# EAGLE design ESP32_Schematic (EAGLE 9.6.2)
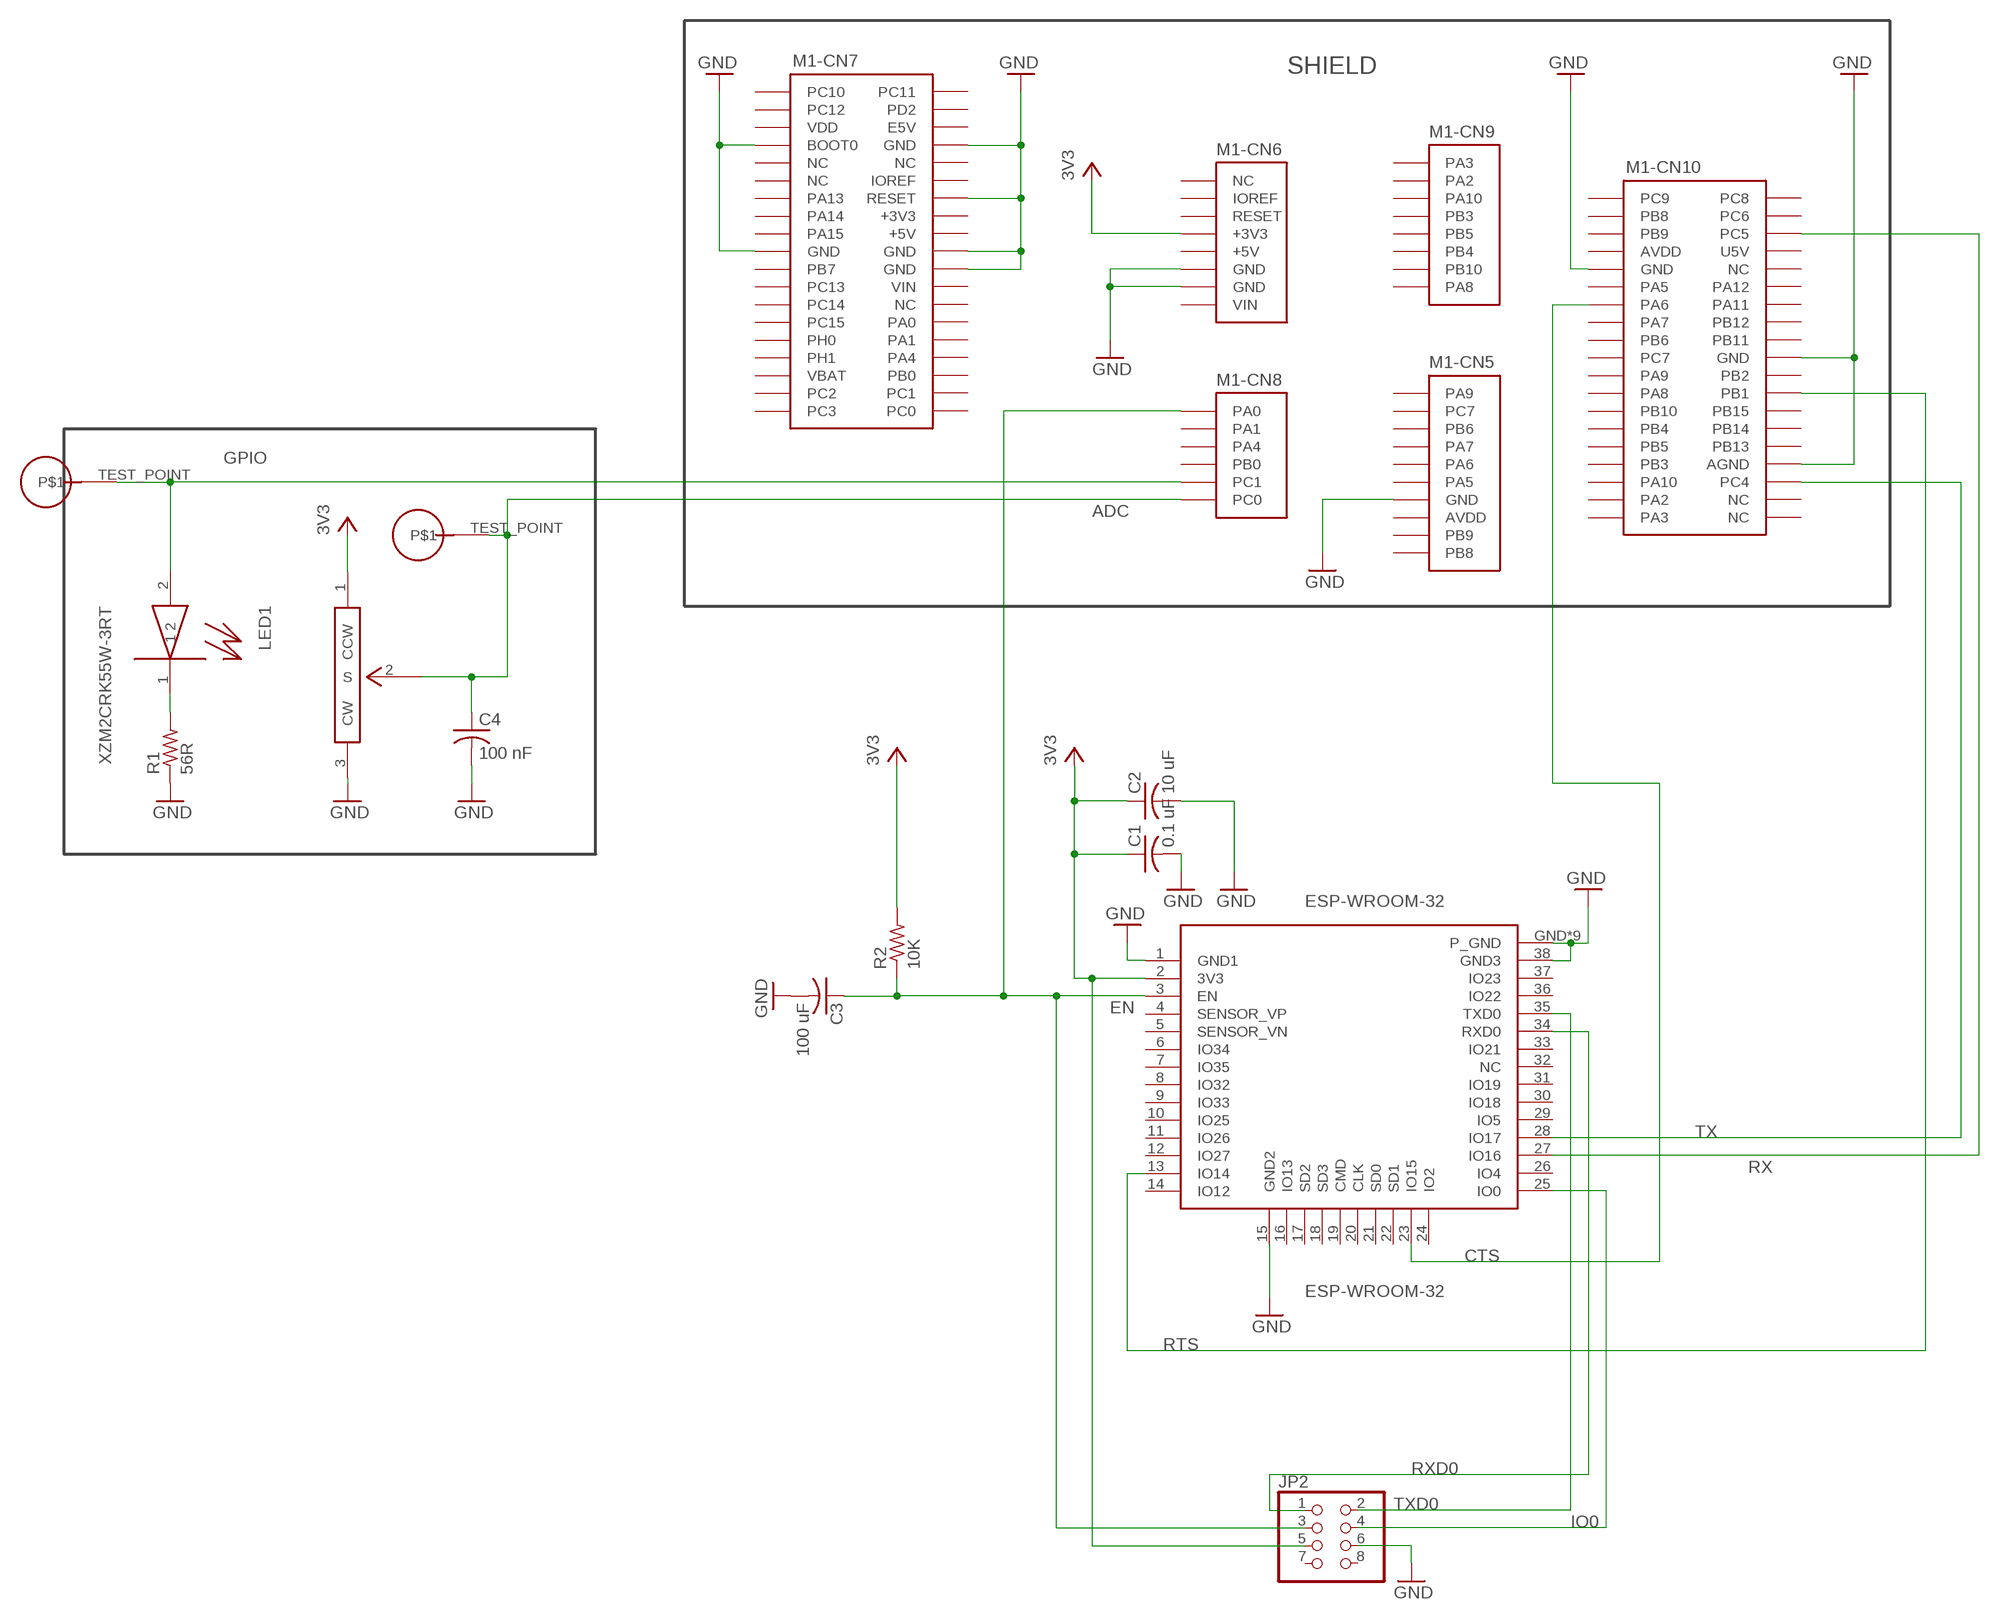
[diagram p0: schematic, sheet 1]

## Parts
C1  0.1 uF  C-USC0805  [C0805]
C2  10 uF  C-USC0805  [C0805]
C3  100 uF  C-USC0805  [C0805]
C4  100 nF  C-USC0805  [C0805]
ESP-WROOM-32  ESP-WROOM-32  [ESP-WROOM-32]
JP2  PINHD-2X4  [2X04]
LED1  XZM2CRK55W-3RT  [CHIPLED]
M1  NUCLEO-L452RE  [NUCLEO-64]
POT1  P160KNP  [P160KN-0QD15B10K]
R1  56R  R-US_R0805  [R0805]
R2  10K  R-US_R0805  [R0805]
TP_LED  TEST_POINT  [TEST_POINT]
TP_POT  TEST_POINT  [TEST_POINT]

## Nets
ADC: C4.1 M1.CN8-6(-CN8:PC0) POT1.2(S) TP_POT.TEST_POINT
CTS: ESP-WROOM-32.23(IO15) M1.CN10-13(-CN10:PA6)
EN: C3.1 ESP-WROOM-32.3(EN) JP2.3 M1.CN8-1(-CN8:PA0) R2.1
GND: C1.2 C2.2 C3.2 C4.2 ESP-WROOM-32.1(GND1) ESP-WROOM-32.15(GND2) ESP-WROOM-32.38(GND3) ESP-WROOM-32.GND1(P_GND) ESP-WROOM-32.GND2(P_GND) ESP-WROOM-32.GND3(P_GND) ESP-WROOM-32.GND4(P_GND) ESP-WROOM-32.GND5(P_GND) ESP-WROOM-32.GND6(P_GND) ESP-WROOM-32.GND7(P_GND) ESP-WROOM-32.GND8(P_GND) ESP-WROOM-32.GND(P_GND) JP2.6 M1.CN5-7(-CN5:GND) M1.CN6-6(-CN6:GND) M1.CN6-7(-CN6:GND) M1.CN7-7(-CN7:BOOT0) M1.CN7-8(-CN7:GND) M1.CN7-14(-CN7:RESET) M1.CN7-19(-CN7:GND) M1.CN7-20(-CN7:GND) M1.CN7-22(-CN7:GND) M1.CN10-9(-CN10:GND) M1.CN10-20(-CN10:GND) M1.CN10-32(-CN10:AGND) POT1.3(CW) R1.1
GPIO: LED1.2 M1.CN8-5(-CN8:PC1) TP_LED.TEST_POINT
IO0: ESP-WROOM-32.25(IO0) JP2.4
N$8: LED1.1 R1.2
RTS: ESP-WROOM-32.13(IO14) M1.CN10-24(-CN10:PB1)
RX: ESP-WROOM-32.27(IO16) M1.CN10-6(-CN10:PC5)
RXD0: ESP-WROOM-32.34(RXD0) JP2.1
TX: ESP-WROOM-32.28(IO17) M1.CN10-34(-CN10:PC4)
TXD0: ESP-WROOM-32.35(TXD0) JP2.2
VCC: C1.1 C2.1 ESP-WROOM-32.2(3V3) JP2.5 M1.CN6-4(-CN6:+3V3) POT1.1(CCW) R2.2 ; supply symbol labelled 3V3
Unconnected: ESP-WROOM-32.4(SENSOR_VP) ESP-WROOM-32.5(SENSOR_VN) ESP-WROOM-32.6(IO34) ESP-WROOM-32.7(IO35) ESP-WROOM-32.8(IO32) ESP-WROOM-32.9(IO33) ESP-WROOM-32.10(IO25) ESP-WROOM-32.11(IO26) ESP-WROOM-32.12(IO27) ESP-WROOM-32.14(IO12) ESP-WROOM-32.16(IO13) ESP-WROOM-32.17(SD2) ESP-WROOM-32.18(SD3) ESP-WROOM-32.19(CMD) ESP-WROOM-32.20(CLK) ESP-WROOM-32.21(SD0) ESP-WROOM-32.22(SD1) ESP-WROOM-32.24(IO2) ESP-WROOM-32.26(IO4) ESP-WROOM-32.29(IO5) ESP-WROOM-32.30(IO18) ESP-WROOM-32.31(IO19) ESP-WROOM-32.32(NC) ESP-WROOM-32.33(IO21) ESP-WROOM-32.36(IO22) ESP-WROOM-32.37(IO23) JP2.7 JP2.8 M1.CN5-1(-CN5:PA9) M1.CN5-2(-CN5:PC7) M1.CN5-3(-CN5:PB6) M1.CN5-4(-CN5:PA7) M1.CN5-5(-CN5:PA6) M1.CN5-6(-CN5:PA5) M1.CN5-9(-CN5:PB9) M1.CN5-10(-CN5:PB8) M1.CN6-1(-CN6:NC) M1.CN6-3(-CN6:RESET) M1.CN7-1(-CN7:PC10) M1.CN7-2(-CN7:PC11) M1.CN7-3(-CN7:PC12) M1.CN7-4(-CN7:PD2) M1.CN7-6(-CN7:E5V) M1.CN7-9(-CN7:NC) M1.CN7-10(-CN7:NC) M1.CN7-11(-CN7:NC) M1.CN7-12(-CN7:IOREF) M1.CN7-13(-CN7:PA13) M1.CN7-15(-CN7:PA14) M1.CN7-17(-CN7:PA15) M1.CN7-21(-CN7:PB7) M1.CN7-23(-CN7:PC13) M1.CN7-25(-CN7:PC14) M1.CN7-26(-CN7:NC) M1.CN7-27(-CN7:PC15) M1.CN7-28(-CN7:PA0) M1.CN7-29(-CN7:PH0) M1.CN7-30(-CN7:PA1) M1.CN7-31(-CN7:PH1) M1.CN7-32(-CN7:PA4) M1.CN7-34(-CN7:PB0) M1.CN7-35(-CN7:PC2) M1.CN7-36(-CN7:PC1) M1.CN7-37(-CN7:PC3) M1.CN7-38(-CN7:PC0) M1.CN8-2(-CN8:PA1) M1.CN8-3(-CN8:PA4) M1.CN8-4(-CN8:PB0) M1.CN9-1(-CN9:PA3) M1.CN9-2(-CN9:PA2) M1.CN9-3(-CN9:PA10) M1.CN9-4(-CN9:PB3) M1.CN9-5(-CN9:PB5) M1.CN9-6(-CN9:PB4) M1.CN9-7(-CN9:PB10) M1.CN9-8(-CN9:PA8) M1.CN10-1(-CN10:PC9) M1.CN10-2(-CN10:PC8) M1.CN10-3(-CN10:PB8) M1.CN10-4(-CN10:PC6) M1.CN10-5(-CN10:PB9) M1.CN10-10(-CN10:NC) M1.CN10-11(-CN10:PA5) M1.CN10-12(-CN10:PA12) M1.CN10-14(-CN10:PA11) M1.CN10-15(-CN10:PA7) M1.CN10-16(-CN10:PB12) M1.CN10-17(-CN10:PB6) M1.CN10-18(-CN10:PB11) M1.CN10-19(-CN10:PC7) M1.CN10-21(-CN10:PA9) M1.CN10-22(-CN10:PB2) M1.CN10-23(-CN10:PA8) M1.CN10-25(-CN10:PB10) M1.CN10-26(-CN10:PB15) M1.CN10-27(-CN10:PB4) M1.CN10-28(-CN10:PB14) M1.CN10-29(-CN10:PB5) M1.CN10-30(-CN10:PB13) M1.CN10-31(-CN10:PB3) M1.CN10-33(-CN10:PA10) M1.CN10-35(-CN10:PA2) M1.CN10-36(-CN10:NC) M1.CN10-37(-CN10:PA3) M1.CN10-38(-CN10:NC)

## Notes on the sheet
- SHIELD

## Power pins joined to a net without a drawn wire
+3V3: M1.CN7-16(-CN7:+3V3)
+5V: M1.CN6-5(-CN6:+5V) M1.CN7-18(-CN7:+5V)
AVDD: M1.CN5-8(-CN5:AVDD) M1.CN10-7(-CN10:AVDD)
IOREF: M1.CN6-2(-CN6:IOREF)
U5V: M1.CN10-8(-CN10:U5V)
VBAT: M1.CN7-33(-CN7:VBAT)
VDD: M1.CN7-5(-CN7:VDD)
VIN: M1.CN6-8(-CN6:VIN) M1.CN7-24(-CN7:VIN)

## Library data of the parts
C1 C4 = C-US:C-US: CAPACITOR, American symbol; PARTNO: GCM21BR72A104KA37L; SPICEPREFIX: C
C2 = C-US:C-US: CAPACITOR, American symbol; PARTNO: GRM21BR61C106KE15L; SPICEPREFIX: C
C3 = C-US:C-US: CAPACITOR, American symbol; PARTNO: GRM21BR60J107ME15L; SPICEPREFIX: C
ESP-WROOM-32 = ESP-WROOOM-32:ESP-WROOM-32
JP2 = pinhead:PINHD-2X4: PIN HEADER; PARTNO: 220-1-08-003
LED1 = XZM2CRK55W-3RT - SunLED:XZM2CRK55W-3RT; PARTNO: XZM2CRK55W-3RT
M1 = NUCLEO-L452RE:NUCLEO-L452RE: No existe un outline (Layer Dimension) para esta librería. En su lugar se utilizó una referencia en tDocu. Al momento de diseñar la tarjeta, el Dimension debe ser dibujado según los requerimientos del usuario, o simplemente copiar los contenidos del tDocu en Dimensions.
POT1 = P160KNP:P160KNP
R1 = R-US:R-US_: RESISTOR, American symbol; PARTNO: RC0805JR-0756RL; SPICEPREFIX: R
R2 = R-US:R-US_: RESISTOR, American symbol; PARTNO: RC0805FR-0710KL; SPICEPREFIX: R
TP_LED TP_POT = TEST_POINT:TEST_POINT

## Board
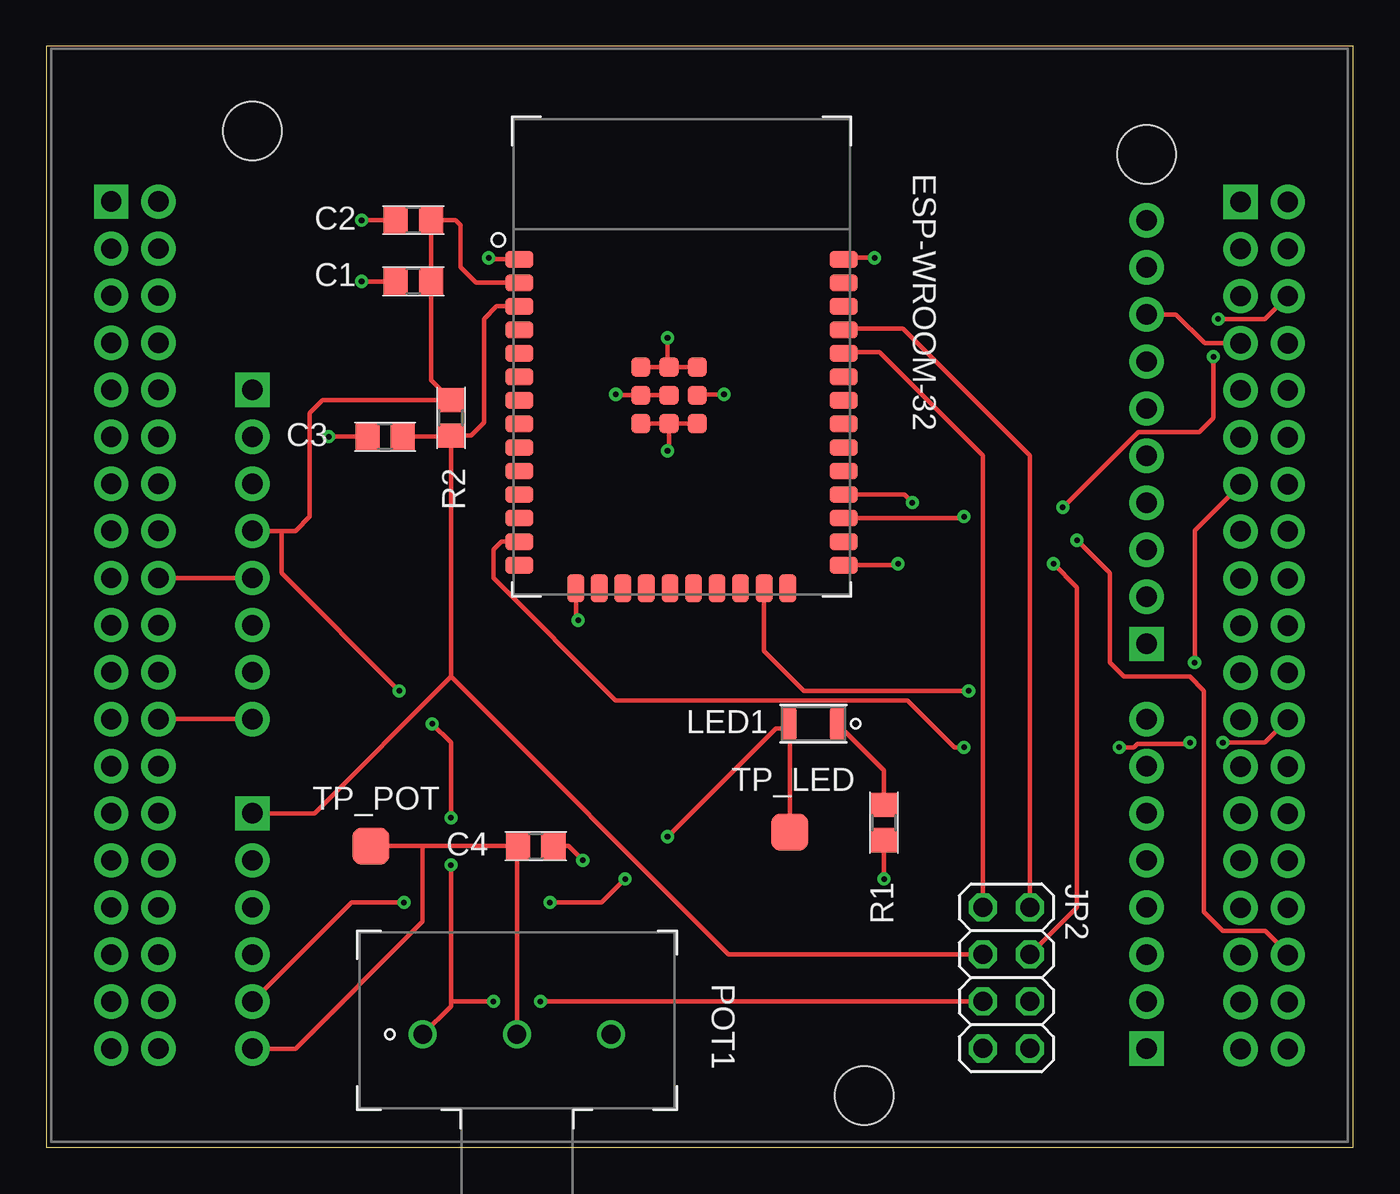
[diagram p1: board, top side]
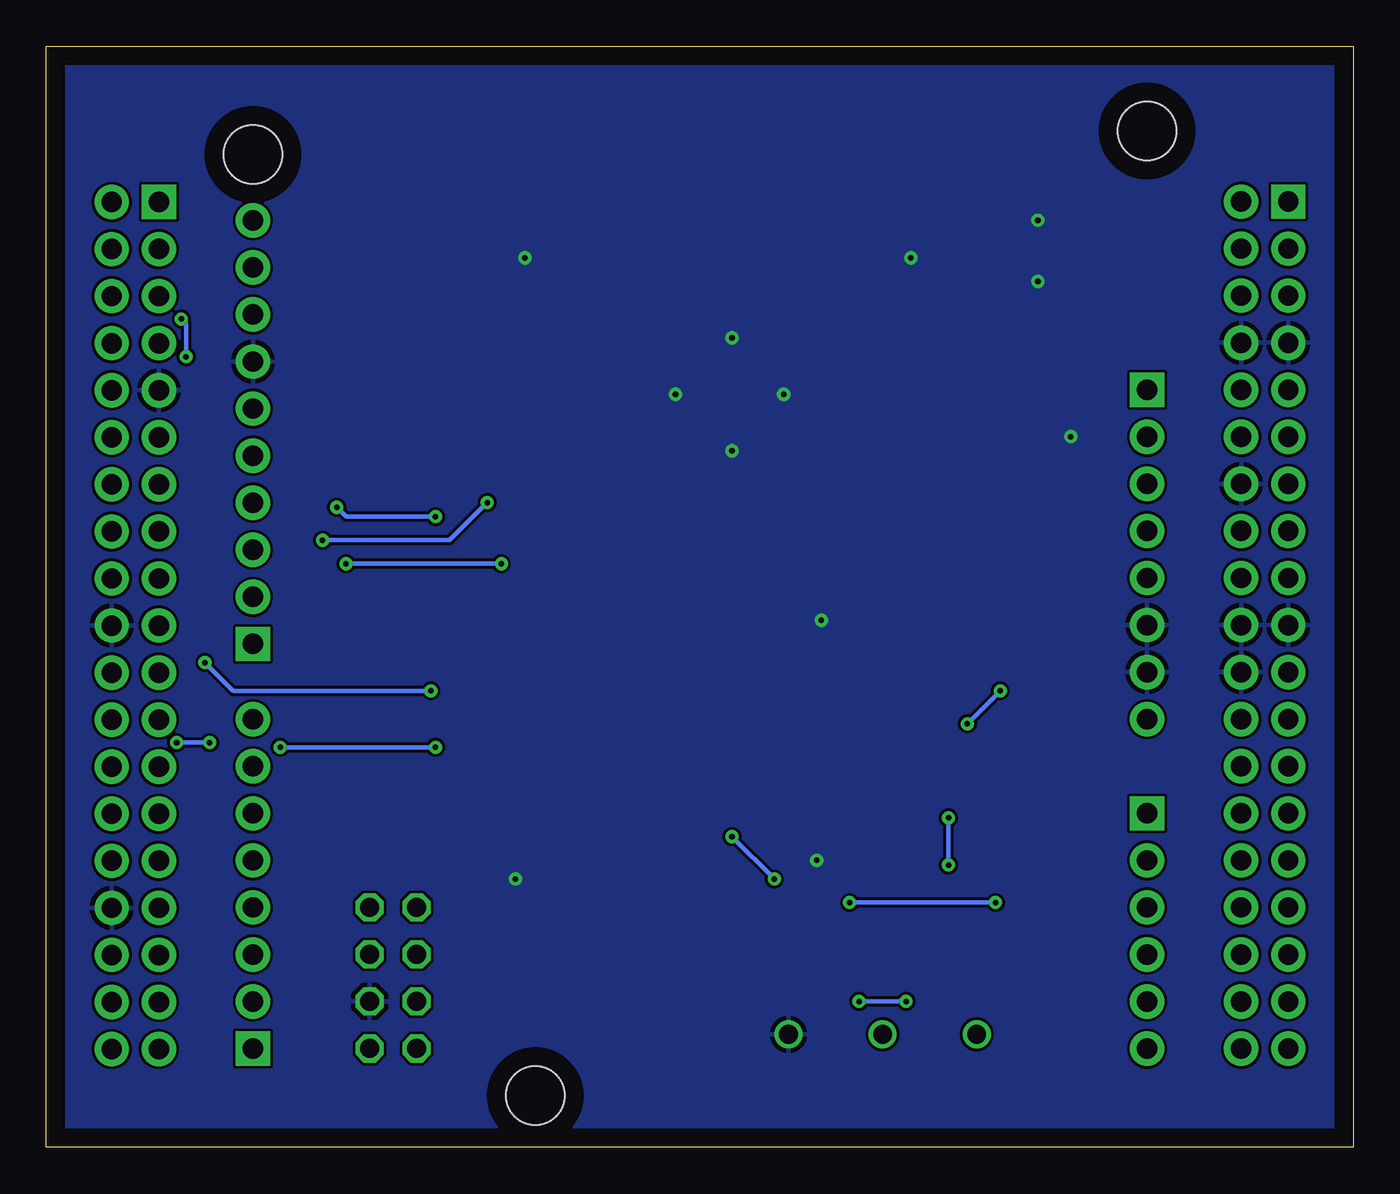
[diagram p2: board, bottom side, seen from below]

Size 70.54 x 59.43 mm. Coordinates in mm from the lower left corner, seen from the top.
Outline: 0,0 70.54,0 70.54,59.43 0,59.43 0,0
Copper layers (1*16): Top 0.035mm / dielectric 1.5mm / Bottom 0.035mm
Design rules "default *": minimum track width 6mil, minimum drill 0.3mm, track to track 6mil, track to pad 6mil, pad to pad 6mil, via to via 6mil, smd to smd 6mil, copper to edge 40mil, drill to drill 6mil, minimum pad ring 10mil, minimum via ring 8mil, stop-mask expansion 2mil, vias tented up to drill 0.3mm, thermal gap 10mil

### Footprints (pad centres in the part's own frame; a part is rotated, then mirrored left to right if it is on the bottom)
C0805 = smd 1.3 x 1.5: 1 -0.95,0; 2 0.95,0
ESP-WROOM-32 = smd 1.5 x 0.9: 1 -8.75,5.26; 2 -8.75,3.99; 3 -8.75,2.72; 4 -8.75,1.45; 5 -8.75,0.18; 6 -8.75,-1.09; 7 -8.75,-2.36; 8 -8.75,-3.63; 9 -8.75,-4.9; 10 -8.75,-6.17; 11 -8.75,-7.44; 12 -8.75,-8.71; 13 -8.75,-9.98; 14 -8.75,-11.25; 25 8.75,-11.25; 26 8.75,-9.98; 27 8.75,-8.71; 28 8.75,-7.44; 29 8.75,-6.17; 30 8.75,-4.9; 31 8.75,-3.63; 32 8.75,-2.36; 33 8.75,-1.09; 34 8.75,0.18; 35 8.75,1.45; 36 8.75,2.72; 37 8.75,3.99; 38 8.75,5.26 | smd 0.9 x 1.5: 15 -5.71,-12.5; 16 -4.44,-12.5; 17 -3.17,-12.5; 18 -1.9,-12.5; 19 -0.63,-12.5; 20 0.64,-12.5; 21 1.91,-12.5; 22 3.18,-12.5; 23 4.45,-12.5; 24 5.72,-12.5 | smd 1.05 x 1.05: GND -0.68,-2.08; GND1 -2.205,-0.555; GND2 -0.68,-0.555; GND3 0.845,-0.555; GND4 -2.205,-2.08; GND5 0.845,-2.08; GND6 -2.205,-3.605; GND7 -0.68,-3.605; GND8 0.845,-3.605
2X04 = drill 1.016 octagon: 1 -3.81,-1.27; 2 -3.81,1.27; 3 -1.27,-1.27; 4 -1.27,1.27; 5 1.27,-1.27; 6 1.27,1.27; 7 3.81,-1.27; 8 3.81,1.27
CHIPLED = smd 0.813 x 1.803: 1 -1.295,0; 2 1.295,0
NUCLEO-64 = drill 1.1 pad 1.85 square: CN5-1 59.13,24.884; CN6-1 10.87,38.6; CN7-1 3.25,48.76; CN8-1 10.87,15.74; CN9-1 59.13,3.04; CN10-1 64.21,48.735 | drill 1.1 pad 1.85: CN5-2 59.13,27.424; CN5-3 59.13,29.964; CN5-4 59.13,32.504; CN5-5 59.13,35.044; CN5-6 59.13,37.584; CN5-7 59.13,40.124; CN5-8 59.13,42.664; CN5-9 59.13,45.204; CN5-10 59.13,47.744; CN6-2 10.87,36.06; CN6-3 10.87,33.52; CN6-4 10.87,30.98; CN6-5 10.87,28.44; CN6-6 10.87,25.9; CN6-7 10.87,23.36; CN6-8 10.87,20.82; CN7-2 5.79,48.76; CN7-3 3.25,46.22; CN7-4 5.79,46.22; CN7-5 3.25,43.68; CN7-6 5.79,43.68; CN7-7 3.25,41.14; CN7-8 5.79,41.14; CN7-9 3.25,38.6; CN7-10 5.79,38.6; CN7-11 3.25,36.06; CN7-12 5.79,36.06; CN7-13 3.25,33.52; CN7-14 5.79,33.52; CN7-15 3.25,30.98; CN7-16 5.79,30.98; CN7-17 3.25,28.44; CN7-18 5.79,28.44; CN7-19 3.25,25.9; CN7-20 5.79,25.9; CN7-21 3.25,23.36; CN7-22 5.79,23.36; CN7-23 3.25,20.82; CN7-24 5.79,20.82; CN7-25 3.25,18.28; CN7-26 5.79,18.28; CN7-27 3.25,15.74; CN7-28 5.79,15.74; CN7-29 3.25,13.2; CN7-30 5.79,13.2; CN7-31 3.25,10.66; CN7-32 5.79,10.66; CN7-33 3.25,8.12; CN7-34 5.79,8.12; CN7-35 3.25,5.58; CN7-36 5.79,5.58; CN7-37 3.25,3.04; CN7-38 5.79,3.04; CN8-2 10.87,13.2; CN8-3 10.87,10.66; CN8-4 10.87,8.12; CN8-5 10.87,5.58; CN8-6 10.87,3.04; CN9-2 59.13,5.58; CN9-3 59.13,8.12; CN9-4 59.13,10.66; CN9-5 59.13,13.2; CN9-6 59.13,15.74; CN9-7 59.13,18.28; CN9-8 59.13,20.82; CN10-2 66.75,48.735; CN10-3 64.21,46.195; CN10-4 66.75,46.195; CN10-5 64.21,43.655; CN10-6 66.75,43.655; CN10-7 64.21,41.115; CN10-8 66.75,41.115; CN10-9 64.21,38.575; CN10-10 66.75,38.575; CN10-11 64.21,36.035; CN10-12 66.75,36.035; CN10-13 64.21,33.495; CN10-14 66.75,33.495; CN10-15 64.21,30.955; CN10-16 66.75,30.955; CN10-17 64.21,28.415; CN10-18 66.75,28.415; CN10-19 64.21,25.875; CN10-20 66.75,25.875; CN10-21 64.21,23.335; CN10-22 66.75,23.335; CN10-23 64.21,20.795; CN10-24 66.75,20.795; CN10-25 64.21,18.255; CN10-26 66.75,18.255; CN10-27 64.21,15.715; CN10-28 66.75,15.715; CN10-29 64.21,13.175; CN10-30 66.75,13.175; CN10-31 64.21,10.635; CN10-32 66.75,10.635; CN10-33 64.21,8.095; CN10-34 66.75,8.095; CN10-35 64.21,5.555; CN10-36 66.75,5.555; CN10-37 64.21,3.015; CN10-38 66.75,3.015 | hole 3.175: 59.13,51.3; 10.87,52.57; 43.89,0.5
P160KN-0QD15B10K = drill 1: 1 0,-5.08; 2 0,0; 3 0,5.08
R0805 = smd 1.3 x 1.5: 1 -0.95,0; 2 0.95,0
TEST_POINT = smd 2 x 2: TEST_POINT 0,0

### Placement (x,y rotation side)
C1  19.81,46.74 180 top
C2  19.81,50.04 180 top
C3  18.29,38.35 180 top
C4  26.42,16.26 0 top
ESP-WROOM-32  34.29,42.67 0 top
JP2  51.82,9.14 270 top
LED1  41.4,22.86 180 top
M1  0.25,2.29 0 top
POT1  25.4,6.1 270 top
R1  45.21,17.53 90 top
R2  21.84,39.37 90 top
TP_LED  40.13,17.02 0 top
TP_POT  17.53,16.26 0 top

### Tracks (layer width: path | path; a pad name or v marks a point on that pad's centre or on a via)
+5V
  Top 0.254: M1.CN6-5 M1.CN7-18
ADC
  Top 0.254: TP_POT.TEST_POINT 20.32,16.26 | 20.32,16.26 C4.1 25.4,16.19 POT1.2 | 20.32,16.26 20.32,12.19 13.45,5.33 M1.CN8-6
AVDD
  Top 0.254: M1.CN5-8 60.97,44.95 62.52,43.4 M1.CN10-7
CTS  (via drill 0.3)
  Top 0.254: ESP-WROOM-32.23 38.74,26.79 40.89,24.64 v49.78,24.64 | v61.98,26.16 61.98,33.29 M1.CN10-13
  Bottom 0.254: v49.78,24.64 60.45,24.64 v61.98,26.16
EN
  Top 0.254: R2.1 21.78,38.35 C3.1 | ESP-WROOM-32.3 24.31,45.39 23.62,44.7 23.62,39.12 22.93,38.42 R2.1 | R2.1 21.84,25.4 | 21.84,25.4 14.47,18.03 M1.CN8-1 | 21.84,25.4 36.83,10.41 JP2.3
GND  (via drill 0.3)
  Top 0.254: ESP-WROOM-32.1 23.95,47.93 v23.88,48.01 | ESP-WROOM-32.38 43.11,48.01 v44.7,48.01 | ESP-WROOM-32.GND7 33.61,37.67 v33.53,37.59 | ESP-WROOM-32.GND2 33.53,42.2 v33.53,43.69 | v30.73,40.64 30.78,40.59 ESP-WROOM-32.GND4 ESP-WROOM-32.GND | ESP-WROOM-32.GND5 35.18,40.64 v36.58,40.64 | ESP-WROOM-32.GND1 ESP-WROOM-32.GND2 | ESP-WROOM-32.GND3 ESP-WROOM-32.GND2 | ESP-WROOM-32.GND7 ESP-WROOM-32.GND8 | ESP-WROOM-32.GND7 ESP-WROOM-32.GND6 | ESP-WROOM-32.15 28.58,28.57 v28.7,28.45 | C3.2 v15.24,38.35 | C1.2 v17.02,46.74 | C2.2 v17.02,50.04 | R1.1 v45.21,14.48 | C4.2 28.19,16.26 v28.96,15.49
  pour Bottom: 0.25,59.18 0.25,0.25 70.1,0.25 70.1,59.18
GPIO  (via drill 0.3)
  Top 0.254: LED1.2 40.13,22.84 40.13,22.61 | 40.13,22.61 TP_LED.TEST_POINT | M1.CN8-5 16.47,13.21 v19.3,13.21 | v27.18,13.21 29.97,13.21 v31.24,14.48 | v33.53,16.76 39.37,22.61 40.13,22.61
  Bottom 0.254: v19.3,13.21 v27.18,13.21 | v31.24,14.48 v33.53,16.76
IO0  (via drill 0.3)
  Top 0.254: JP2.4 55.63,12.95 55.63,30.23 v54.36,31.5 | v45.97,31.5 45.9,31.42 ESP-WROOM-32.25
  Bottom 0.254: v54.36,31.5 v45.97,31.5
N$8
  Top 0.254: R1.2 45.21,20.34 LED1.1
RTS  (via drill 0.3)
  Top 0.254: ESP-WROOM-32.13 24.56,32.69 24.13,32.26 24.13,30.73 30.73,24.13 46.48,24.13 49.02,21.59 v49.53,21.59 | v57.91,21.59 58.7,21.59 58.88,21.77 61.65,21.77 v61.72,21.84 | v63.5,21.84 65.77,21.84 M1.CN10-24
  Bottom 0.254: v49.53,21.59 v57.91,21.59 | v61.72,21.84 v63.5,21.84
RX  (via drill 0.3)
  Top 0.254: ESP-WROOM-32.27 49.46,33.96 v49.53,34.04 | v54.86,34.54 58.93,38.61 62.23,38.61 62.99,39.37 v62.99,42.67 | v63.25,44.7 65.77,44.7 M1.CN10-6
  Bottom 0.254: v49.53,34.04 54.36,34.04 v54.86,34.54 | v62.99,42.67 62.99,44.45 v63.25,44.7
RXD0
  Top 0.254: JP2.1 50.55,37.34 44.96,42.93 43.11,42.93 ESP-WROOM-32.34
TX  (via drill 0.3)
  Top 0.254: ESP-WROOM-32.28 46.3,35.23 v46.74,34.8 | v55.63,32.77 57.4,30.99 57.4,26.16 58.17,25.4 61.72,25.4 62.48,24.64 62.48,12.7 63.5,11.68 65.79,11.68 67,10.47 M1.CN10-34
  Bottom 0.254: v46.74,34.8 48.77,32.77 v55.63,32.77
TXD0
  Top 0.254: JP2.2 53.09,37.34 46.23,44.2 43.11,44.2 ESP-WROOM-32.35
VCC  (via drill 0.3)
  Top 0.254: ESP-WROOM-32.2 23.19,46.66 22.35,47.5 22.35,49.78 22.1,50.04 C2.1 C1.1 20.76,41.4 R2.2 14.92,40.32 14.22,39.62 14.22,34.04 13.45,33.27 12.7,33.27 | 12.7,33.27 M1.CN6-4 | POT1.1 21.84,7.62 21.84,7.87 | 21.84,7.87 v21.84,15.24 | v20.83,22.86 21.84,21.84 v21.84,17.78 | v19.05,24.64 12.7,30.99 12.7,33.27 | JP2.5 v26.67,7.87 | v24.13,7.87 21.84,7.87
  Bottom 0.254: v21.84,15.24 v21.84,17.78 | v20.83,22.86 v19.05,24.64 | v26.67,7.87 v24.13,7.87
VIN
  Top 0.254: M1.CN6-8 M1.CN7-24